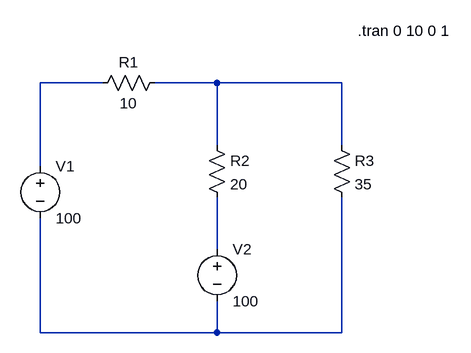
[diagram p0: schematic 1.2.asc]
1.2.asc, the LTspice schematic file:
Version 4.1
SHEET 1 880 680
WIRE 112 128 16 128
WIRE 288 128 192 128
WIRE 480 128 288 128
WIRE 288 224 288 128
WIRE 480 224 480 128
WIRE 16 256 16 128
WIRE 288 384 288 304
WIRE 16 512 16 336
WIRE 288 512 288 464
WIRE 288 512 16 512
WIRE 480 512 480 304
WIRE 480 512 288 512
SYMBOL res 96 144 R270
WINDOW 0 32 56 VTop 2
WINDOW 3 0 56 VBottom 2
SYMATTR InstName R1
SYMATTR Value 10
SYMBOL res 272 208 R0
SYMATTR InstName R2
SYMATTR Value 20
SYMBOL res 464 208 R0
SYMATTR InstName R3
SYMATTR Value 35
SYMBOL voltage 16 240 R0
WINDOW 123 0 0 Left 0
WINDOW 39 0 0 Left 0
SYMATTR InstName V1
SYMATTR Value 100
SYMBOL voltage 288 368 R0
WINDOW 123 0 0 Left 0
WINDOW 39 0 0 Left 0
SYMATTR InstName V2
SYMATTR Value 100
TEXT 504 48 Left 2 !.tran 0 10 0 1

The netlist it stands for:
* 1.2.asc
R1 N001 N002 10
R2 N002 N003 20
R3 N002 N004 35
V1 N001 N004 100
V2 N003 N004 100
.tran 0 10 0 1
.backanno
.end